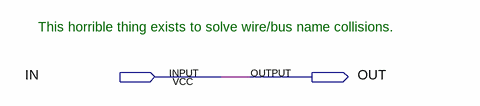
[diagram p0: schematic sheet]
// Quartus schematic empty.bdf as structural Verilog: 0 symbols, 2 pins
module empty (
  input  IN,
  output OUT
);


  assign OUT = IN;

  // Notes on the sheet:
  //   This horrible thing exists to solve wire/bus name collisions.
endmodule
